# EasyEDA schematic SCH_bottomBoard.json
TITLE: Sheet_1; REV: 1.0; Date: 2022-03-06; Sheet: 1/1; Drawn By: liaozhelin; Company: Your Company
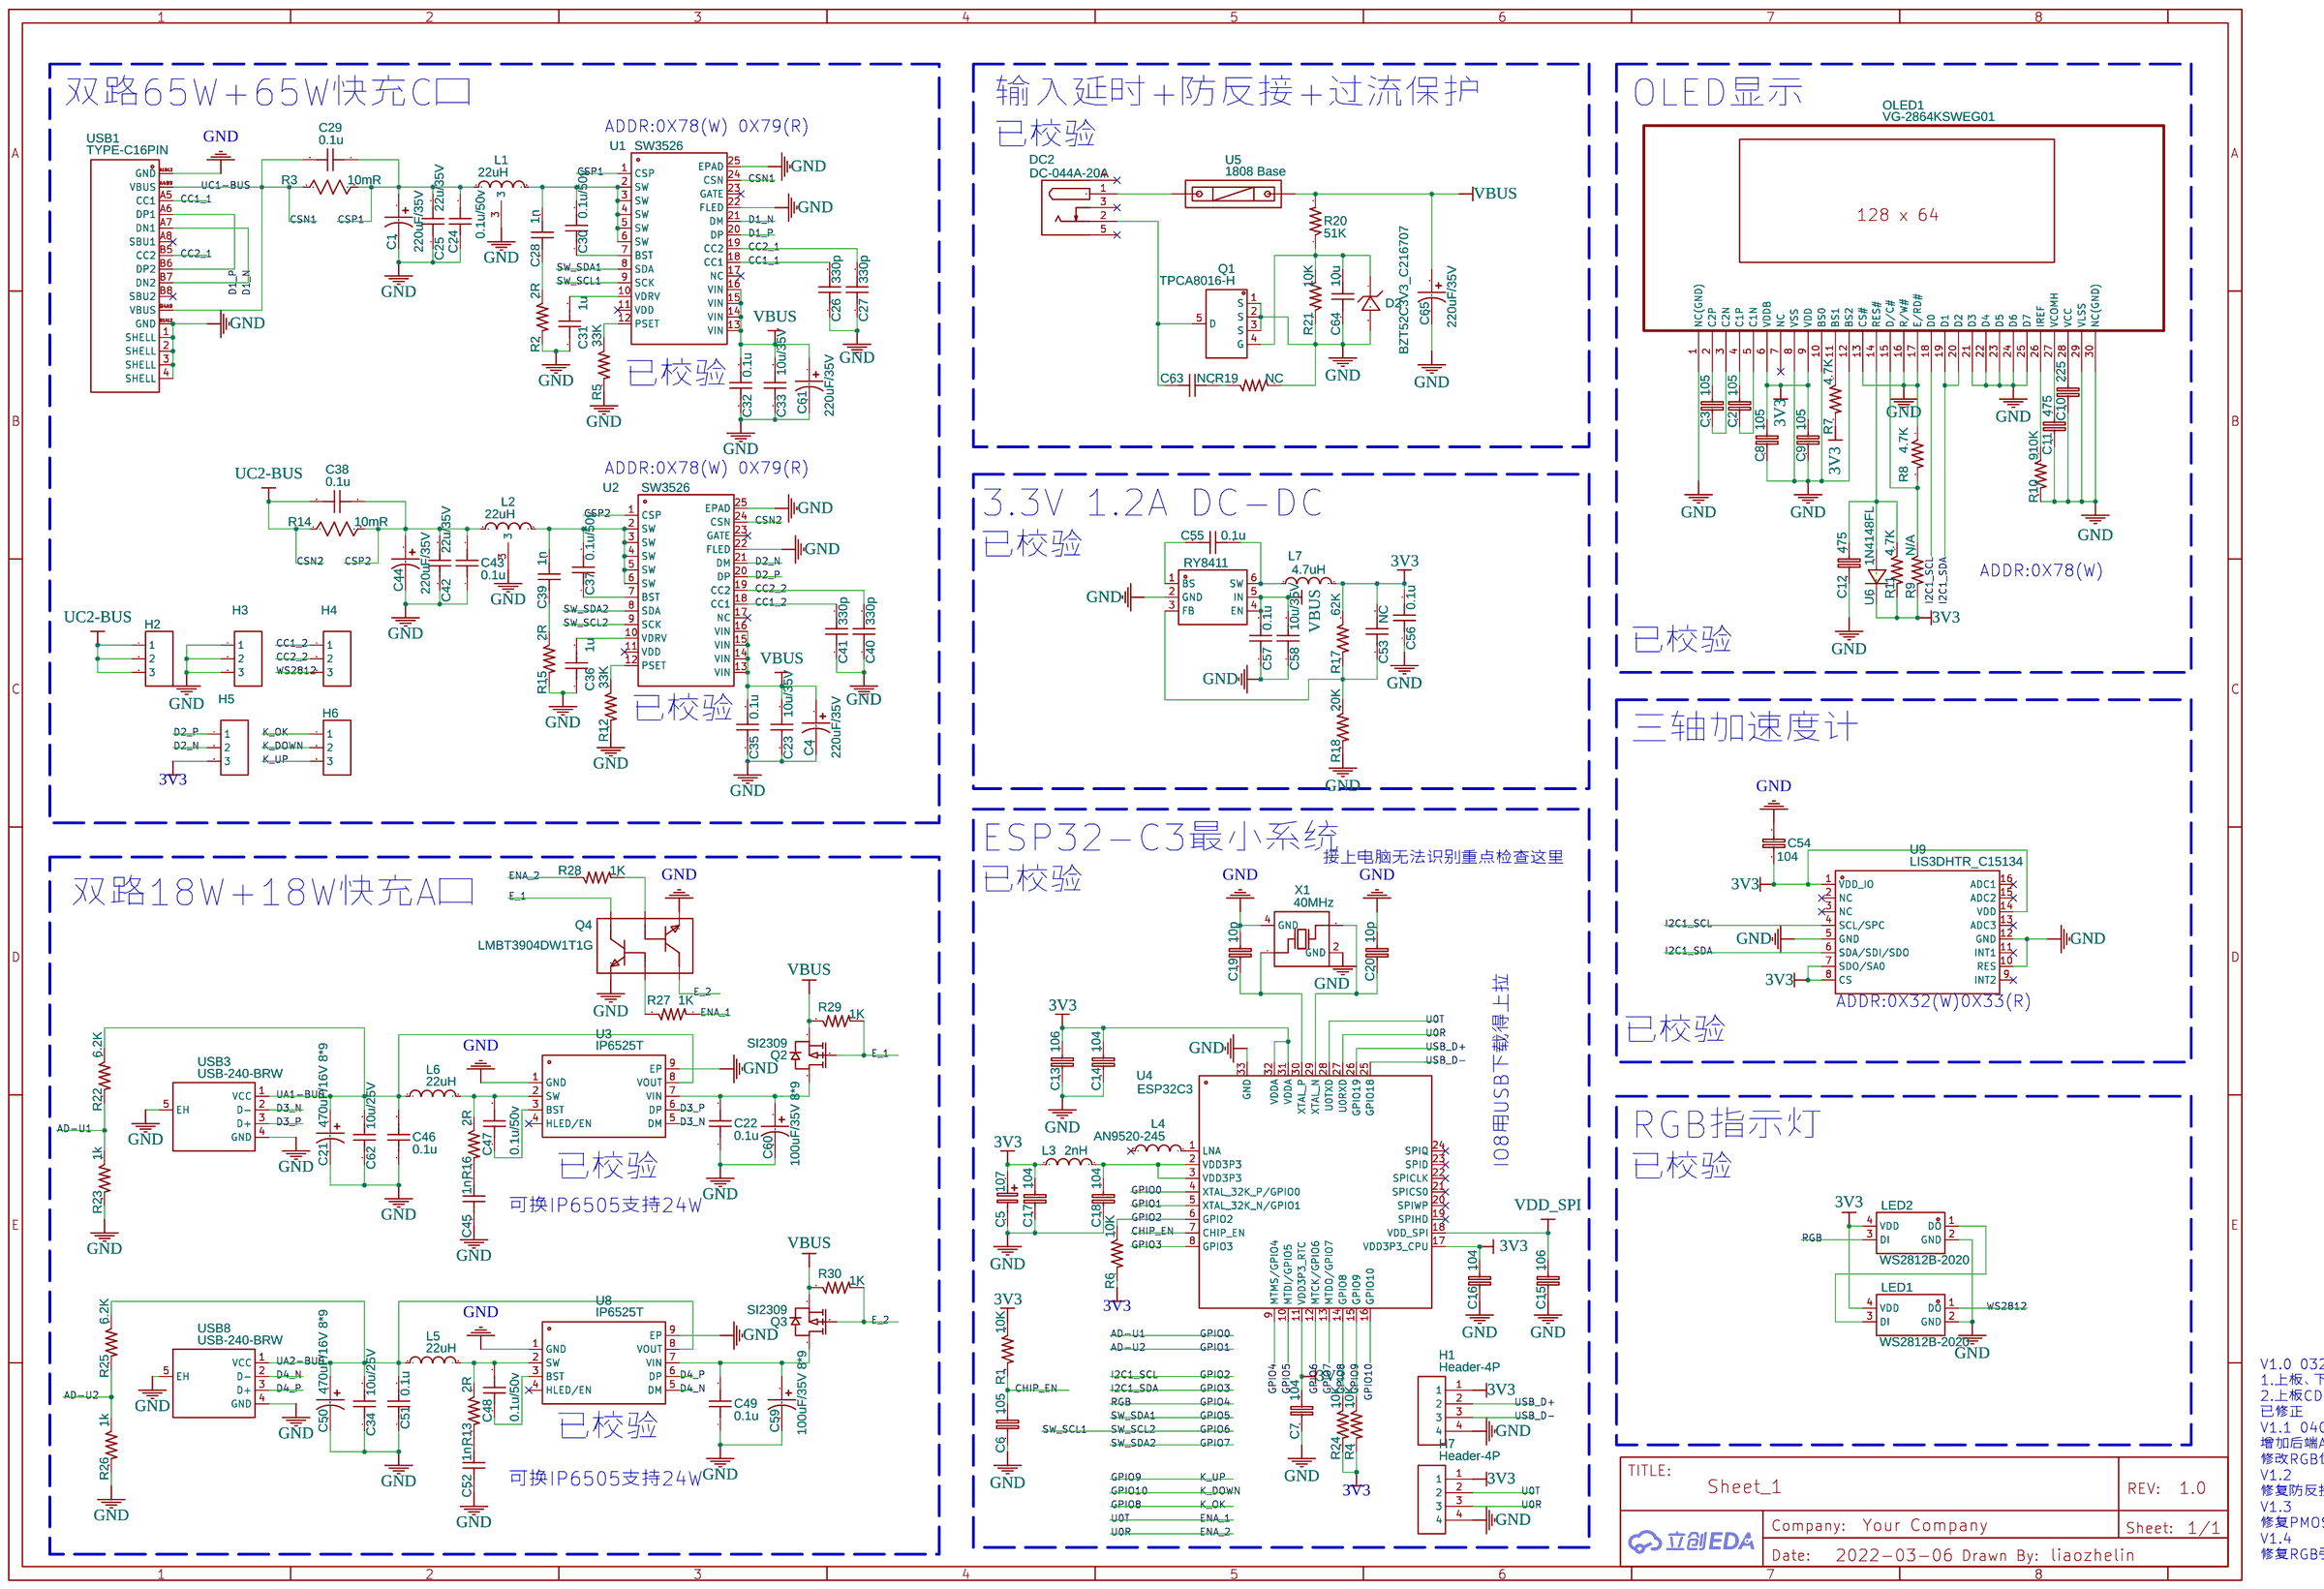
[diagram p0: schematic sheet]

## Parts
BS  RY8411  [SOT-23-6_L2.9-W1.6-P0.95-LS2.8-BL]
C1  220uF/35V  [CAP-TH_BD8.0-P3.50-D0.6-FD]
C2  105  [C0603]
C3  105  [C0603]
C4  220uF/35V  [CAP-TH_BD8.0-P3.50-D0.6-FD]
C5  107  [CASE-B_3528]
C6  105  [C0603]
C7  104  [C0603]
C8  105  [C0603]
C9  105  [C0603]
C10  225  [C0603]
C11  475  [C0603]
C12  475  [C0603]
C13  106  [C0603]
C14  104  [C0603]
C15  106  [C0603]
C16  104  [C0603]
C17  104  [C0603]
C18  104  [C0603]
C19  10p  [C0603]
C20  10p  [C0603]
C21  470uF/16V 8*9  [CAP-TH_BD8.0-P3.50-D0.6-FD]
C22  0.1u  [C0603]
C23  10u/35V  [C0805]
C24  0.1u/50v  [C0603]
C25  22u/35V  [C0805]
C26  330p  [C0603]
C27  330p  [C0603]
C28  1n  [C0603]
C29  0.1u  [C0603]
C30  0.1u/50v  [C0603]
C31  1u  [C0603]
C32  0.1u  [C0603]
C33  10u/35V  [C0805]
C34  10u/25V  [C0805]
C35  0.1u  [C0603]
C36  1u  [C0603]
C37  0.1u/50v  [C0603]
C38  0.1u  [C0603]
C39  1n  [C0603]
C40  330p  [C0603]
C41  330p  [C0603]
C42  22u/35V  [C0805]
C43  0.1u  [C0603]
C44  220uF/35V  [CAP-TH_BD8.0-P3.50-D0.6-FD]
C45  1n  [C0603]
C46  0.1u  [C0603]
C47  0.1u/50v  [C0603]
C48  0.1u/50v  [C0603]
C49  0.1u  [C0603]
C50  470uF/16V 8*9  [CAP-TH_BD8.0-P3.50-D0.6-FD]
C51  0.1u  [C0603]
C52  1n  [C0603]
C53  NC  [C0603]
C54  104  [C0603]
C55  0.1u  [C0603]
C56  0.1u  [C0603]
C57  0.1u  [C0603]
C58  10u/35V  [C0603]
C59  100uF/35V 8*9  [CAP-TH_BD8.0-P3.50-D0.6-FD]
C60  100uF/35V 8*9  [CAP-TH_BD8.0-P3.50-D0.6-FD]
C61  220uF/35V  [CAP-TH_BD8.0-P3.50-D0.6-FD]
C62  10u/25V  [C0805]
C63  NC  [C0603]
C64  10u  [C0805]
C65  220uF/35V  [CAP-TH_BD8.0-P3.50-D0.6-FD]
D2  BZT52C3V3_C216707  [SOD-123_L2.7-W1.6-LS3.7-RD]
DC2  DC-044A-20A  [DC-IN-TH_DC-044A-20A]
H1  Header-4P  [HEADER-4]
H2  HDR-F-2.54_1x3  [HDR-F-2.54_1X3]
H3  HDR-F-2.54_1x3  [HDR-F-2.54_1X3]
H4  HDR-F-2.54_1x3  [HDR-F-2.54_1X3]
H5  HDR-F-2.54_1x3  [HDR-F-2.54_1X3]
H6  HDR-F-2.54_1x3  [HDR-F-2.54_1X3]
H7  Header-4P  [HEADER-4]
L1  22uH  [IND-SMD_3P-L14.5-W14.5]
L2  22uH  [IND-SMD_3P-L14.5-W14.5]
L3  2nH  [L0603]
L4  AN9520-245  [ANT-SMD_L9.5-W2.1]
L5  22uH  [IND-SMD_L12.0-W12.0_CDRH127NP]
L6  22uH  [IND-SMD_L12.0-W12.0_CDRH127NP]
L7  4.7uH  [IND-SMD_L4.0-W4.0_CD43L-10UH]
LED1  WS2812B-2020  [LED-SMD_4P-L2.0-W2.0-TL_WS2812B-2020]
LED2  WS2812B-2020  [LED-SMD_4P-L2.0-W2.0-TL_WS2812B-2020]
OLED1  VG-2864KSWEG01  [OLED_0.96-30P-P0.70-12864]
Q1  TPCA8016-H  [POWERVDFN-8_L6.2-W5.2-P1.27-LS6.0-BL]
Q2  SI2309  [TO-236-3_L2.9-W1.3-P1.90-LS2.4-BR]
Q3  SI2309  [TO-236-3_L2.9-W1.3-P1.90-LS2.4-BR]
Q4  LMBT3904DW1T1G  [SOT-363_L2.0-W1.3-P0.65-LS2.1-TL]
R1  10K  [R0603]
R2  2R  [R0603]
R3  10mR  [R1206]
R4  10K  [R0603]
R5  33K  [R0603]
R6  10K  [R0603]
R7  4.7K  [R0603]
R8  4.7K  [R0603]
R9  N/A  [R0603]
R10  910K  [R0603]
R11  4.7K  [R0603]
R12  33K  [R0603]
R13  2R  [R0603]
R14  10mR  [R1206]
R15  2R  [R0603]
R16  2R  [R0603]
R17  62K  [R0603]
R18  20K  [R0603]
R19  NC  [R0603]
R20  51K  [R0603]
R21  10K  [R0603]
R22  6.2K  [R0603]
R23  1k  [R0603]
R24  10K  [R0603]
R25  6.2K  [R0603]
R26  1k  [R0603]
R27  1K  [R0603]
R28  1K  [R0603]
R29  1K  [R0603]
R30  1K  [R0603]
U1  SW3526  [QFN-24_L4.0-W4.0-P0.50-TL-EP2.5]
U2  SW3526  [QFN-24_L4.0-W4.0-P0.50-TL-EP2.5]
U3  IP6525T  [ESOP-8_L4.9-W3.9-P1.27-LS6.0-BL-EP]
U4  ESP32C3  [QFN-32_L5.0-W5.0-P0.50-BL-EP3.7]
U5  1808 Base  [FUSE-SMD_L9.7-W5.0]
U6  1N4148FL  [SOD-123FL_L2.8-W1.7-LS3.6-RD]
U8  IP6525T  [ESOP-8_L4.9-W3.9-P1.27-LS6.0-BL-EP]
U9  LIS3DHTR_C15134  [LGA-16_L3.0-W3.0-P0.50-TL]
USB1  TYPE-C16PIN  [USB-C-SMD_TYPE-C16PIN]
USB3  USB-240-BRW  [USB-A-TH_USB-240-BRW]
USB8  USB-240-BRW  [USB-A-TH_USB-240-BRW]
X1  40MHz  [CRYSTAL-SMD_4P-L3.2-W2.5-BL]

## Library data of the parts
BS = RY8411: Supplier: LCSC; Supplier Part: C9900000347; JLCPCB Part Class: Extended Part; link: https://img.jlc.com/pdf/applyPasteComponent/2021-09-22/355933A/166a7cbc0ac2488a97d854c8557847ab/RY8411.pdf; Contributor: LCSC
C1 C4 C21 C44 C50 C59-C61 C65 = BC016M821LO8*12L-1A4T: Supplier: LCSC; Supplier Part: C516110; Manufacturer: BERYL Electronic Tech; Contributor: LCSC
C2 C3 C6-C20 C54 = 1.0PF-50V(-_+.25PF)(0603): CAP-07879; Contributor: SparkFun
C5 = C_Tan_SMD_B_EU: Contributor: LCEDA_Lib
C22-C43 C45-C49 C51-C53 C55-C58 C62-C64 = C_0805_US: Contributor: LCEDA_Lib
D2 = BZT52C3V3_C216707: Supplier: LCSC; Supplier Part: C216707; Manufacturer: SK; Manufacturer Part: BZT52C3V3; Contributor: LCSC; JLCPCB Part Class: Extended Part
DC2 = DC-044A-20A: Supplier: LCSC; Manufacturer: HRO; Supplier Part: C129006; JLCPCB Part Class: Extended Part
H1 H7 = Header-4P: Contributor: LiShanwenGit
H2-H6 = HDR-F-2.54_1x3: Supplier Part: C146690; Supplier: LCSC; Contributor: LCEDA_Lib
L1 L2 = CDEP147NP-6R1MC-125: Supplier: LCSC; Supplier Part: C2455724; Manufacturer: Sumida(胜美达); JLCPCB Part Class: Extended Part; Contributor: LCSC
L3 = L0603_US: Contributor: LCEDA_Lib
L4 = AN9520-245: Supplier: LCSC; Manufacturer: Rainsun; Supplier Part: C99665; JLCPCB Part Class: Extended Part
L5 L6 = CDRH127NP-470MC: Supplier: LCSC; Manufacturer: Sumida; Contributor: LCSC; Supplier Part: C167265; JLCPCB Part Class: Extended Part
L7 = CD43(L)-10UH: Supplier: LCSC; Supplier Part: C9900005836; Manufacturer Part: CD43(L)-10uH; JLCPCB Part Class: Extended Part; Contributor: LCSC
LED1 LED2 = WS2812B-2020: Supplier: LCSC; Supplier Part: C965555; Manufacturer: Worldsemi; Contributor: LCSC; JLCPCB Part Class: Extended Part
OLED1 = VG-2864KSWEG01: Supplier: LCSC; Supplier Part: C194313; Manufacturer: WiseChip; Contributor: LCSC; JLCPCB Part Class: Extended Part
Q1 = TPCA8016-H: Supplier: LCSC; Manufacturer: TOSHIBA; Supplier Part: C37805
Q2 Q3 = SI2309CDS-T1-E3: Supplier: LCSC; Supplier Part: C553975; Manufacturer: VISHAY(威世); Contributor: LCSC; JLCPCB Part Class: Extended Part
Q4 = LMBT3904DW1T1G: Supplier: LCSC; Manufacturer: LRC; Supplier Part: C131781; JLCPCB Part Class: Extended Part
R1 R2 R4-R13 R15-R30 = 1.2MOHMS-1_10W-1%(0603): RES-10055; Contributor: SparkFun
R3 R14 = R_1206_US: Contributor: LCEDA_Lib
U1 U2 = SW3526: Supplier: LCSC; Supplier Part: C2912236; Manufacturer: null; JLCPCB Part Class: Extended Part; Contributor: LCSC
U3 U8 = IP6525T: Supplier: LCSC; Supplier Part: C432573; Manufacturer: INJOINIC; Contributor: LCSC; JLCPCB Part Class: Extended Part
U4 = ESP32C3: Supplier: LCSC; Manufacturer: ESPRESSIF; image: //image.lceda.cn/szlcsc/C77967.jpg; Supplier Part: C77967; Paste Type: expand; Contributor: ap321
U5 = 1808 Base: Supplier: LCSC; Manufacturer: ReliaPro; Supplier Part: C3133; JLCPCB Part Class: Extended Part
U6 = 1N4148FL: Supplier: LCSC; Supplier Part: C2874197; Manufacturer: 艾吉芯(Agertech); Contributor: LCSC
U9 = LIS3DHTR_C15134: Supplier: LCSC; Manufacturer Part: LIS3DHTR; Manufacturer: STMicroelectronics; Supplier Part: C15134; JLCPCB Part Class: Extended Part
USB1 = TYPE-C16PIN: Supplier: LCSC; Supplier Part: C393939; Manufacturer: SHOU HAN; Contributor: LCSC
USB3 USB8 = USB-240-BRW: Supplier: LCSC; Supplier Part: C720530; Manufacturer: XUNPU; Contributor: LCSC; JLCPCB Part Class: Extended Part
X1 = SX32Y040000BF1T: Supplier: LCSC; Supplier Part: C271642; Manufacturer: TKD; Contributor: LCSC; JLCPCB Part Class: Extended Part

## Nets
3V3: C5.1 C7.1 C8.1 C9.1 C13.1 C14.1 C16.1 C17.1 C53.2 C54.2 C56.2 H1.1 H5.3 H7.1 L3.1 L7.2 LED1.4(VDD) LED2.4(VDD) OLED1.6(VDDB) OLED1.9(VDD) R1.1 R4.2 R6.2 R7.2 R9.2 R11.2 R17.1 R24.2 U4.11(VDD3P3_RTC) U4.17(VDD3P3_CPU) U4.31(VDDA) U4.32(VDDA) U6.1(C) U9.1(VDD_IO) U9.7(SDO/SA0) U9.8(CS) U9.14(VDD)
GND: BS.2(GND) C1.2 C4.2 C5.2 C6.2 C7.2 C8.2 C9.2 C10.2 C11.2 C12.2 C13.2 C14.2 C15.2 C16.2 C17.2 C18.2 C19.1 C20.1 C21.2 C22.1 C23.1 C24.1 C25.1 C26.1 C27.1 C31.1 C32.1 C33.1 C34.1 C35.1 C36.1 C40.1 C41.1 C42.1 C43.1 C44.2 C45.1 C46.1 C49.1 C50.2 C51.1 C52.1 C54.1 C56.1 C57.2 C58.1 C59.2 C60.2 C61.2 C62.1 C64.1 C65.2 D2.2 H1.4 H3.1 H3.2 H3.3 H7.4 L1.3 L2.3 LED1.2(GND) LED2.2(GND) OLED1.1(NC(GND)) OLED1.8(VSS) OLED1.10(BS0) OLED1.12(BS2) OLED1.13(CS#) OLED1.16(R/W#) OLED1.17(E/RD#) OLED1.21(D3) OLED1.22(D4) OLED1.23(D5) OLED1.24(D6) OLED1.25(D7) OLED1.29(VLSS) OLED1.30(NC(GND)) Q1.1(S) Q1.2(S) Q1.3(S) Q4.1(E) Q4.4(E) R2.2 R5.2 R8.1 R10.2 R12.2 R15.2 R18.2 R19.2 R21.1 R23.2 R26.2 U1.22(FLED) U1.25(EPAD) U2.22(FLED) U2.25(EPAD) U3.1(GND) U3.9(EP) U4.33(GND) U8.1(GND) U8.9(EP) U9.5(GND) U9.10(RES) U9.12(GND) USB1.1(SHELL) USB1.2(SHELL) USB1.3(SHELL) USB1.4(SHELL) USB1.A1B12(GND) USB1.B1A12(GND) USB3.4(GND) USB3.5(EH) USB8.4(GND) USB8.5(EH) X1.2(GND) X1.4(GND)
VBUS: BS.4(EN) BS.5(IN) C4.1 C23.2 C32.2 C33.2 C35.2 C57.1 C58.2 C61.1 C65.1 Q2.2(S) Q3.2(S) R20.2 R29.1 R30.1 U1.13(VIN) U1.14(VIN) U1.15(VIN) U1.16(VIN) U2.13(VIN) U2.14(VIN) U2.15(VIN) U2.16(VIN) U5.2
VDD_SPI: C15.1 U4.18(VDD_SPI)
AD-U1: R22.2 R23.1 U4.4(XTAL_32K_P/GPIO0)
AD-U2: R25.2 R26.1 U4.5(XTAL_32K_N/GPIO1)
CC1_1: C26.2 U1.18(CC1) USB1.A5(CC1)
CC1_2: C41.2 H4.1 U2.18(CC1)
CC2_1: C27.2 U1.19(CC2) USB1.B5(CC2)
CC2_2: C40.2 H4.2 U2.19(CC2)
CHIP_EN: C6.1 R1.2 U4.7(CHIP_EN)
CSN1: C29.2 R3.1 U1.24(CSN) USB1.A4B9(VBUS) USB1.B4A9(VBUS)
CSN2: C38.2 H2.1 H2.2 H2.3 R14.1 U2.24(CSN)
CSP1: C1.1 C24.2 C25.2 C29.1 L1.2 R3.2 U1.1(CSP)
CSP2: C38.1 C42.2 C43.2 C44.1 L2.2 R14.2 U2.1(CSP)
D1_N: U1.21(DM) USB1.A7(DN1) USB1.B7(DN2)
D1_P: U1.20(DP) USB1.A6(DP1) USB1.B6(DP2)
D2_N: H5.2 U2.21(DM)
D2_P: H5.1 U2.20(DP)
D3_N: U3.5(DM) USB3.2(D-)
D3_P: U3.6(DP) USB3.3(D+)
D4_N: U8.5(DM) USB8.2(D-)
D4_P: U8.6(DP) USB8.3(D+)
E_1: Q2.1(G) Q4.6(C) R29.2
E_2: Q3.1(G) Q4.3(C) R30.2
ENA_1: H7.2 R27.2 U4.28(U0TXD)
ENA_2: H7.3 R28.1 U4.27(U0RXD)
GPIO2: OLED1.18(D0) R6.1 U4.6(GPIO2) U9.4(SCL/SPC)
GPIO3: OLED1.19(D1) OLED1.20(D2) U4.8(GPIO3) U9.6(SDA/SDI/SDO)
GPIO4: LED2.3(DI) U4.9(MTMS/GPIO4)
GPIO5: U1.8(SDA) U4.10(MTDI/GPIO5)
GPIO6: U1.9(SCK) U2.9(SCK) U4.12(MTCK/GPIO6)
GPIO7: U2.8(SDA) U4.13(MTDO/GPIO7)
GPIO8: H6.1 R24.1 U4.14(GPIO8)
GPIO9: H6.3 R4.1 U4.15(GPIO9)
GPIO10: H6.2 U4.16(GPIO10)
UA1-BUS: C21.1 C46.2 C62.2 L6.1 R22.1 U3.8(VOUT) USB3.1(VCC)
UA2-BUS: C34.2 C50.1 C51.2 L5.1 R25.1 U8.8(VOUT) USB8.1(VCC)
USB_D+: H1.2 U4.26(GPIO19)
USB_D-: H1.3 U4.25(GPIO18)
WS2812: H4.3 LED1.1(DO)
Net-(BS-1): BS.1(BS) C55.2
Net-(BS-3): BS.3(FB) C53.1 R17.2 R18.1
Net-(BS-6): BS.6(SW) C55.1 L7.1
Net-(C2-1): C2.1 OLED1.4(C1P)
Net-(C2-2): C2.2 OLED1.5(C1N)
Net-(C3-1): C3.1 OLED1.2(C2P)
Net-(C3-2): C3.2 OLED1.3(C2N)
Net-(C10-1): C10.1 OLED1.28(VCC)
Net-(C11-1): C11.1 OLED1.27(VCOMH)
Net-(C12-1): C12.1 OLED1.14(RES#) R11.1 U6.2(A)
Net-(C18-1): C18.1 L3.2 U4.2(VDD3P3) U4.3(VDD3P3)
Net-(C19-2): C19.2 U4.30(XTAL_P) X1.1(OSC1)
Net-(C20-2): C20.2 U4.29(XTAL_N) X1.3(OSC2)
Net-(C22-2): C22.2 C60.1 Q2.3(D) U3.7(VIN)
Net-(C28-1): C28.1 R2.1
Net-(C28-2): C28.2 C30.2 L1.1 U1.2(SW) U1.3(SW) U1.4(SW) U1.5(SW) U1.6(SW)
Net-(C30-1): C30.1 U1.7(BST)
Net-(C31-2): C31.2 U1.10(VDRV)
Net-(C36-2): C36.2 U2.10(VDRV)
Net-(C37-1): C37.1 U2.7(BST)
Net-(C37-2): C37.2 C39.2 L2.1 U2.2(SW) U2.3(SW) U2.4(SW) U2.5(SW) U2.6(SW)
Net-(C39-1): C39.1 R15.1
Net-(C45-2): C45.2 R16.2
Net-(C47-1): C47.1 U3.3(BST)
Net-(C47-2): C47.2 L6.2 R16.1 U3.2(SW)
Net-(C48-1): C48.1 U8.3(BST)
Net-(C48-2): C48.2 L5.2 R13.1 U8.2(SW)
Net-(C49-2): C49.2 C59.1 Q3.3(D) U8.7(VIN)
Net-(C52-2): C52.2 R13.2
Net-(C63-1): C63.1 R19.1
Net-(C63-2): C63.2 DC2.2 Q1.5(D)
Net-(C64-2): C64.2 D2.1 Q1.4(G) R20.1 R21.2
Net-(DC2-1): DC2.1 U5.1
Net-(L4-1): L4.1 U4.1(LNA)
Net-(LED1-3): LED1.3(DI) LED2.1(DO)
Net-(OLED1-11): OLED1.11(BS1) R7.1
Net-(OLED1-15): OLED1.15(D/C#) R8.2 R9.1
Net-(OLED1-26): OLED1.26(IREF) R10.1
Net-(Q4-2): Q4.2(B) R27.1
Net-(Q4-5): Q4.5(B) R28.2
Net-(R5-1): R5.1 U1.12(PSET)
Net-(R12-1): R12.1 U2.12(PSET)

Not connected (* = marked no-connect by the designer): DC2 3* 4* 5*; L4 2*; OLED1 7(NC)*; U1 11(VDD)* 17(NC)* 23(GATE)*; U2 11(VDD)* 17(NC)* 23(GATE)*; U3 4(HLED/EN)*; U4 19(SPIHD)* 20(SPIWP)* 21(SPICS0)* 22(SPICLK)* 23(SPID)* 24(SPIQ)*; U8 4(HLED/EN)*; U9 2(NC)* 3(NC)* 9(INT2)* 11(INT1)* 13(ADC3)* 15(ADC2)* 16(ADC1)*; USB1 A8(SBU1)* B8(SBU2)*

## Notes on the sheet
- 双路65W+65W快充C口
- 输入延时+防反接+过流保护
- OLED显示
- ADDR:0X78(W) 0X79(R)
- 已校验
- 已校验
- ADDR:0X78(W) 0X79(R)
- 3.3V 1.2A DC-DC
- 已校验
- ADDR:0X78(W)
- 已校验
- 已校验
- 三轴加速度计
- ESP32-C3最小系统
- 接上电脑无法识别重点检查这里
- 已校验
- 双路18W+18W快充A口
- ADDR:0X32(W)0X33(R)
- 已校验
- RGB指示灯
- 已校验
- 已校验
- IO8用USB下载得上拉
- 可换IP6505支持24W
- V1.0 0320问题：
  1.上板、下板宽度太宽，缩0.5mm
  2.上板CDEP电感孔太小
  已修正
  V1.1 0409修改：
  增加后端A口控制MOS
  修改RGB位置
  V1.2
  修复防反接外壳接地问题
  V1.3
  修复PMOS控制问题
  V1.4
  修复RGB引脚绑定错误
- 已校验
- 可换IP6505支持24W
